# EasyEDA schematic SCH.json
TITLE: Sheet_1; REV: 1.0; Date: 2023-08-08; Sheet: 1/1; Drawn By: max39; Company: Your Company
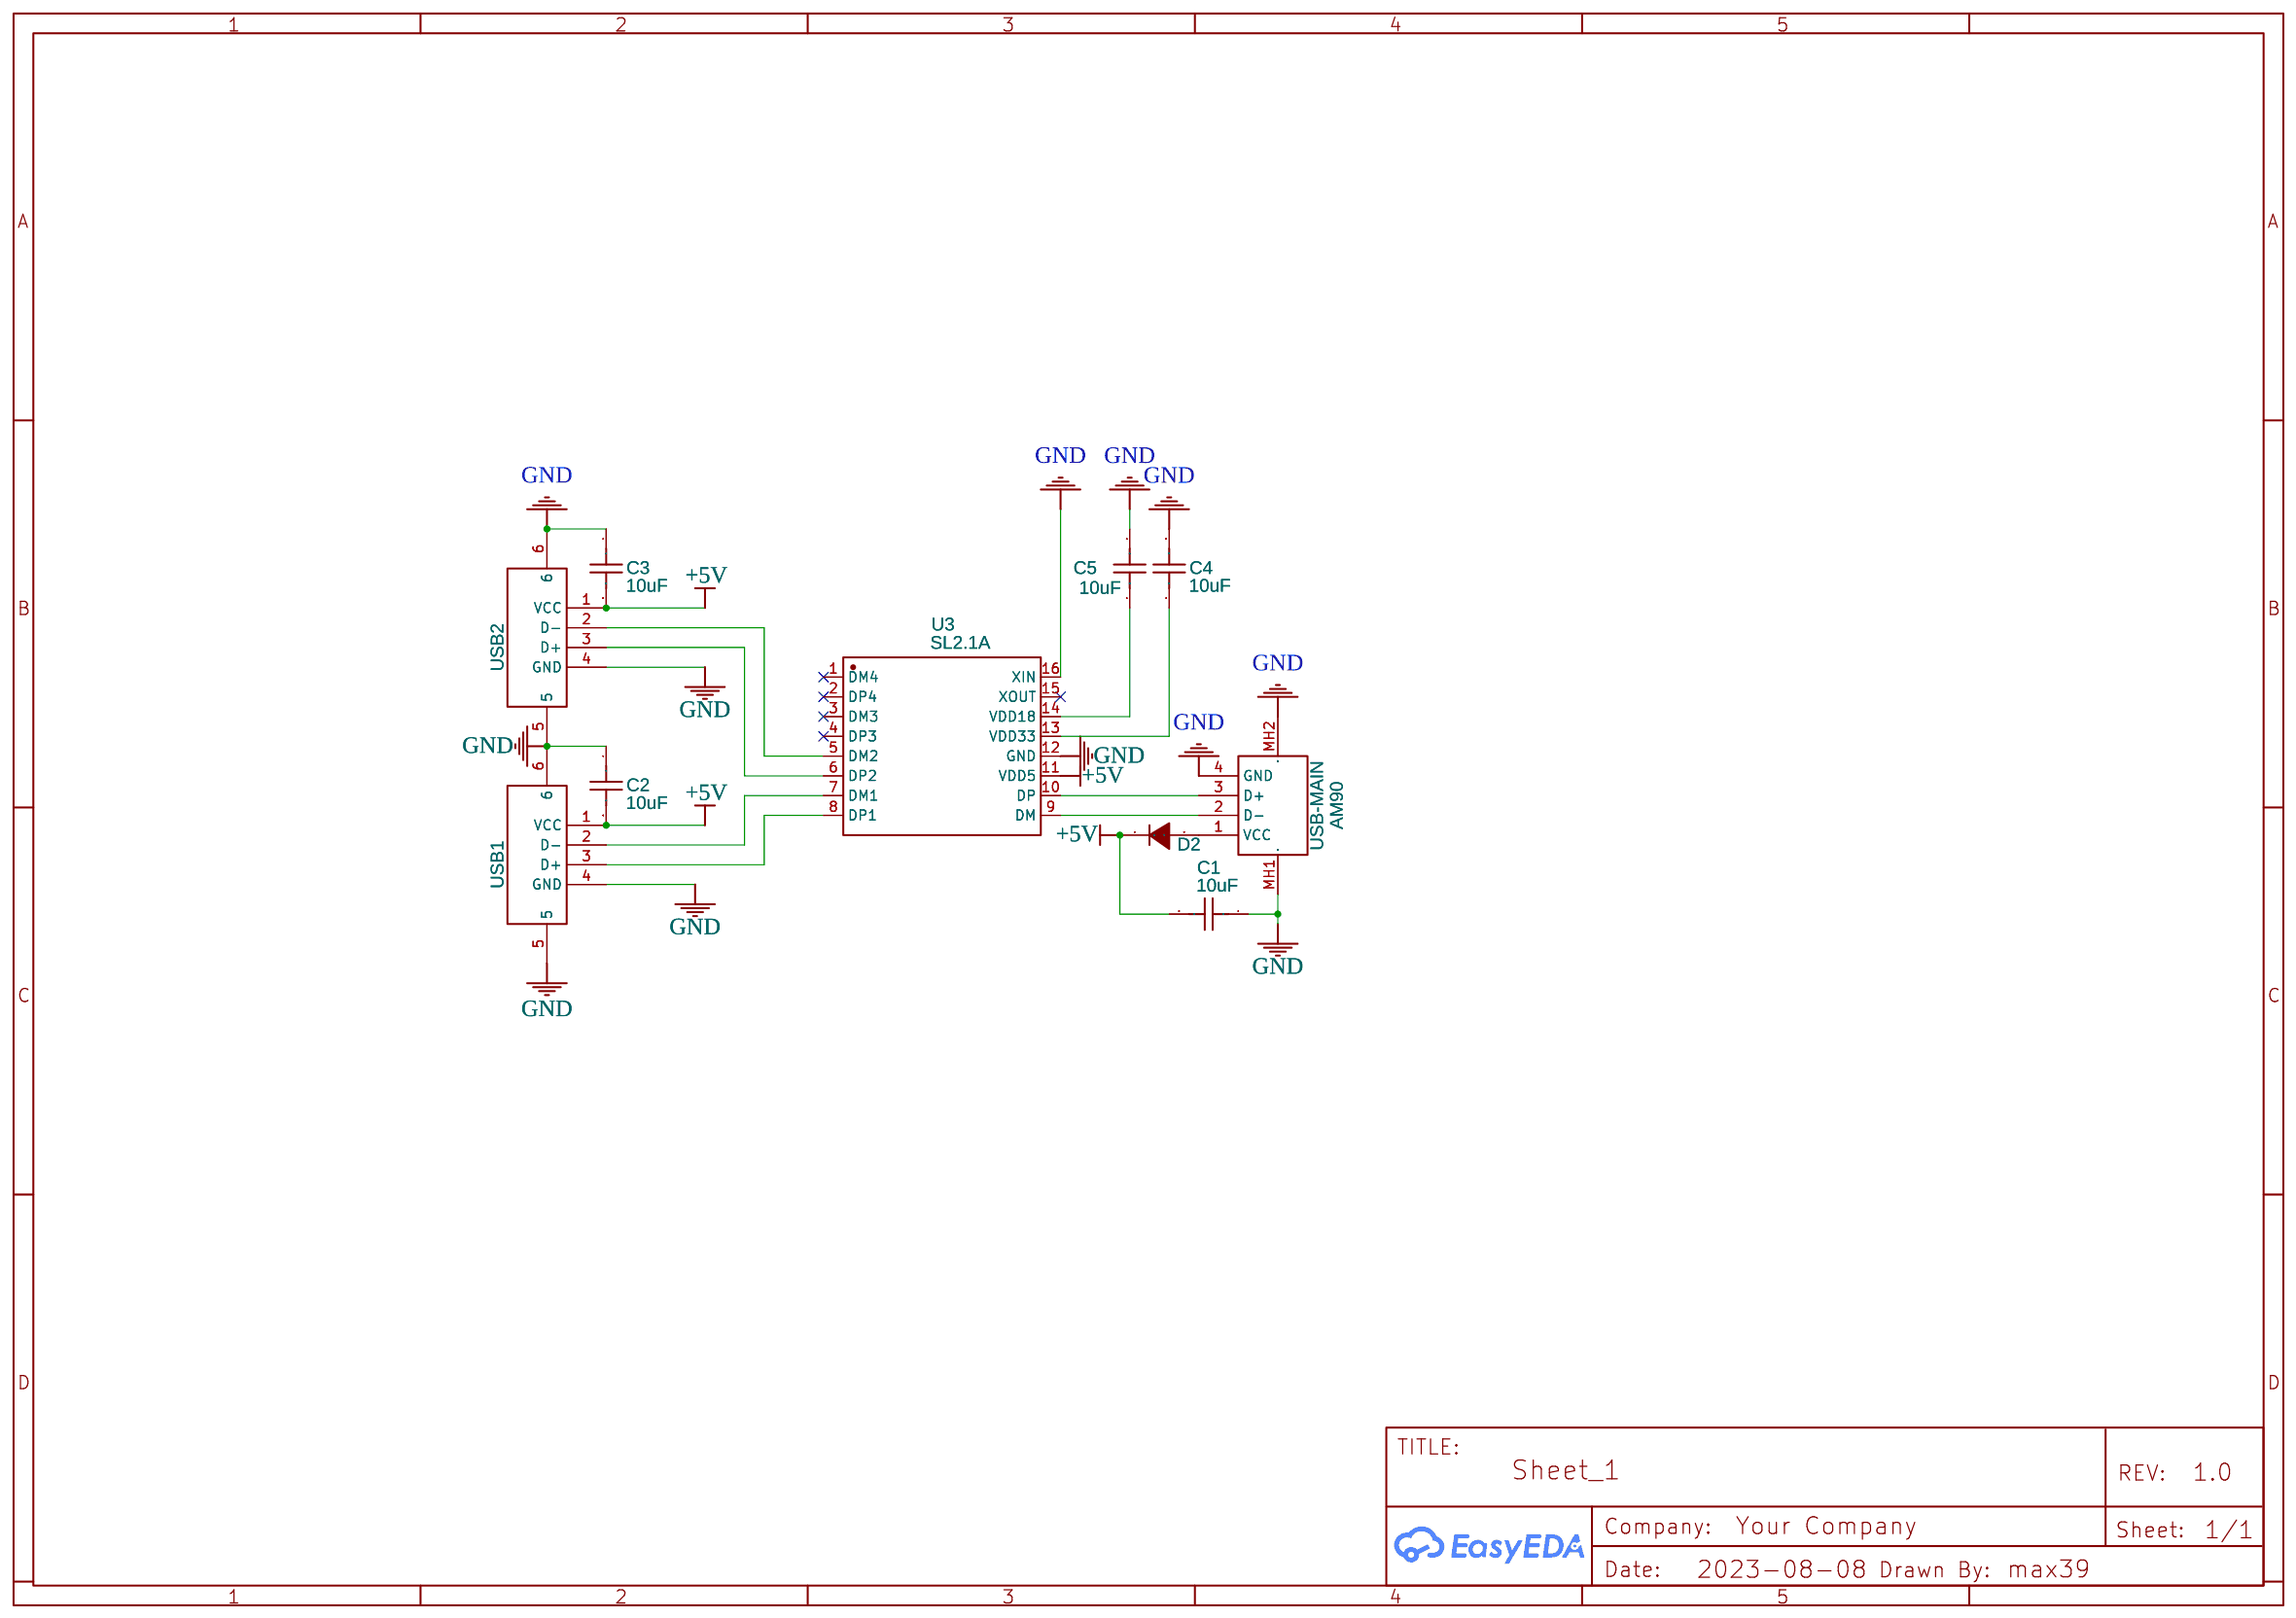
[diagram p0: schematic sheet]

## Parts
C1  10uF  [C0603]
C2  10uF  [C0603]
C3  10uF  [C0603]
C4  10uF  [C0603]
C5  10uF  [C0603]
D2  NSR0320MW2T1G  [SOD-323_L1.8-W1.3-LS2.5-RD]
U3  SL2.1A  [SOP-16_L10.0-W3.9-P1.27-LS6.0-BL]
USB1  USB-AF-90-14.4X13.6-H7.0-DIP  [USB-A-TH_C46407]
USB2  USB-AF-90-14.4X13.6-H7.0-DIP  [USB-A-TH_C46407]
USB-MAIN  AM90  [USB-AM-TH_AM90]

## Library data of the parts
C1-C3 = CL10A106KP8NNNC: Supplier: LCSC; Manufacturer: SAMSUNG(三星); Supplier Part: C19702; JLCPCB Part Class: Basic Part; link: https://lcsc.com/eda_search?q=C19702&%26type=1&ref=editor
C4 C5 = C_0603_US: Contributor: LCEDA_Lib
D2 = NSR0320MW2T1G: Supplier: LCSC; Manufacturer: onsemi(安森美); Supplier Part: C48192; JLCPCB Part Class: Extended Part; link: https://lcsc.com/eda_search?q=C48192&%26type=1&ref=editor
U3 = SL2.1A: Contributor: LCSC; Supplier: LCSC; Supplier Part: C192893; Manufacturer: CoreChips(和芯润德); JLCPCB Part Class: Extended Part; link: https://lcsc.com/eda_search?q=C192893&%26type=1&ref=editor
USB1 USB2 = USB-AF-90-14.4X13.6-H7.0-DIP: Contributor: LCSC; Supplier: LCSC; Supplier Part: C46407; Manufacturer: 精拓金; Manufacturer Part: 903-131A1011D10100; JLCPCB Part Class: Extended Part; link: https://lcsc.com/eda_search?q=C46407&%26type=1&ref=editor
USB-MAIN = AM90: Contributor: LCSC; Supplier: LCSC; Supplier Part: C98125

## Nets
+5V: C1.2 C2.2 C3.2 D2.1(C) U3.11(VDD5) USB1.1(VCC) USB2.1(VCC)
GND: C1.1 C2.1 C3.1 C4.2 C5.2 U3.12(GND) U3.16(XIN) USB1.4(GND) USB1.5 USB1.6 USB2.4(GND) USB2.5 USB2.6 USB-MAIN.4(GND) USB-MAIN.MH1 USB-MAIN.MH2
Net-(C4-1): C4.1 U3.13(VDD33)
Net-(C5-1): C5.1 U3.14(VDD18)
Net-(D2-2): D2.2(A) USB-MAIN.1(VCC)
Net-(U3-5): U3.5(DM2) USB2.2(D-)
Net-(U3-6): U3.6(DP2) USB2.3(D+)
Net-(U3-7): U3.7(DM1) USB1.2(D-)
Net-(U3-8): U3.8(DP1) USB1.3(D+)
Net-(U3-9): U3.9(DM) USB-MAIN.2(D-)
Net-(U3-10): U3.10(DP) USB-MAIN.3(D+)

Not connected (* = marked no-connect by the designer): U3 1(DM4)* 2(DP4)* 3(DM3)* 4(DP3)* 15(XOUT)*
